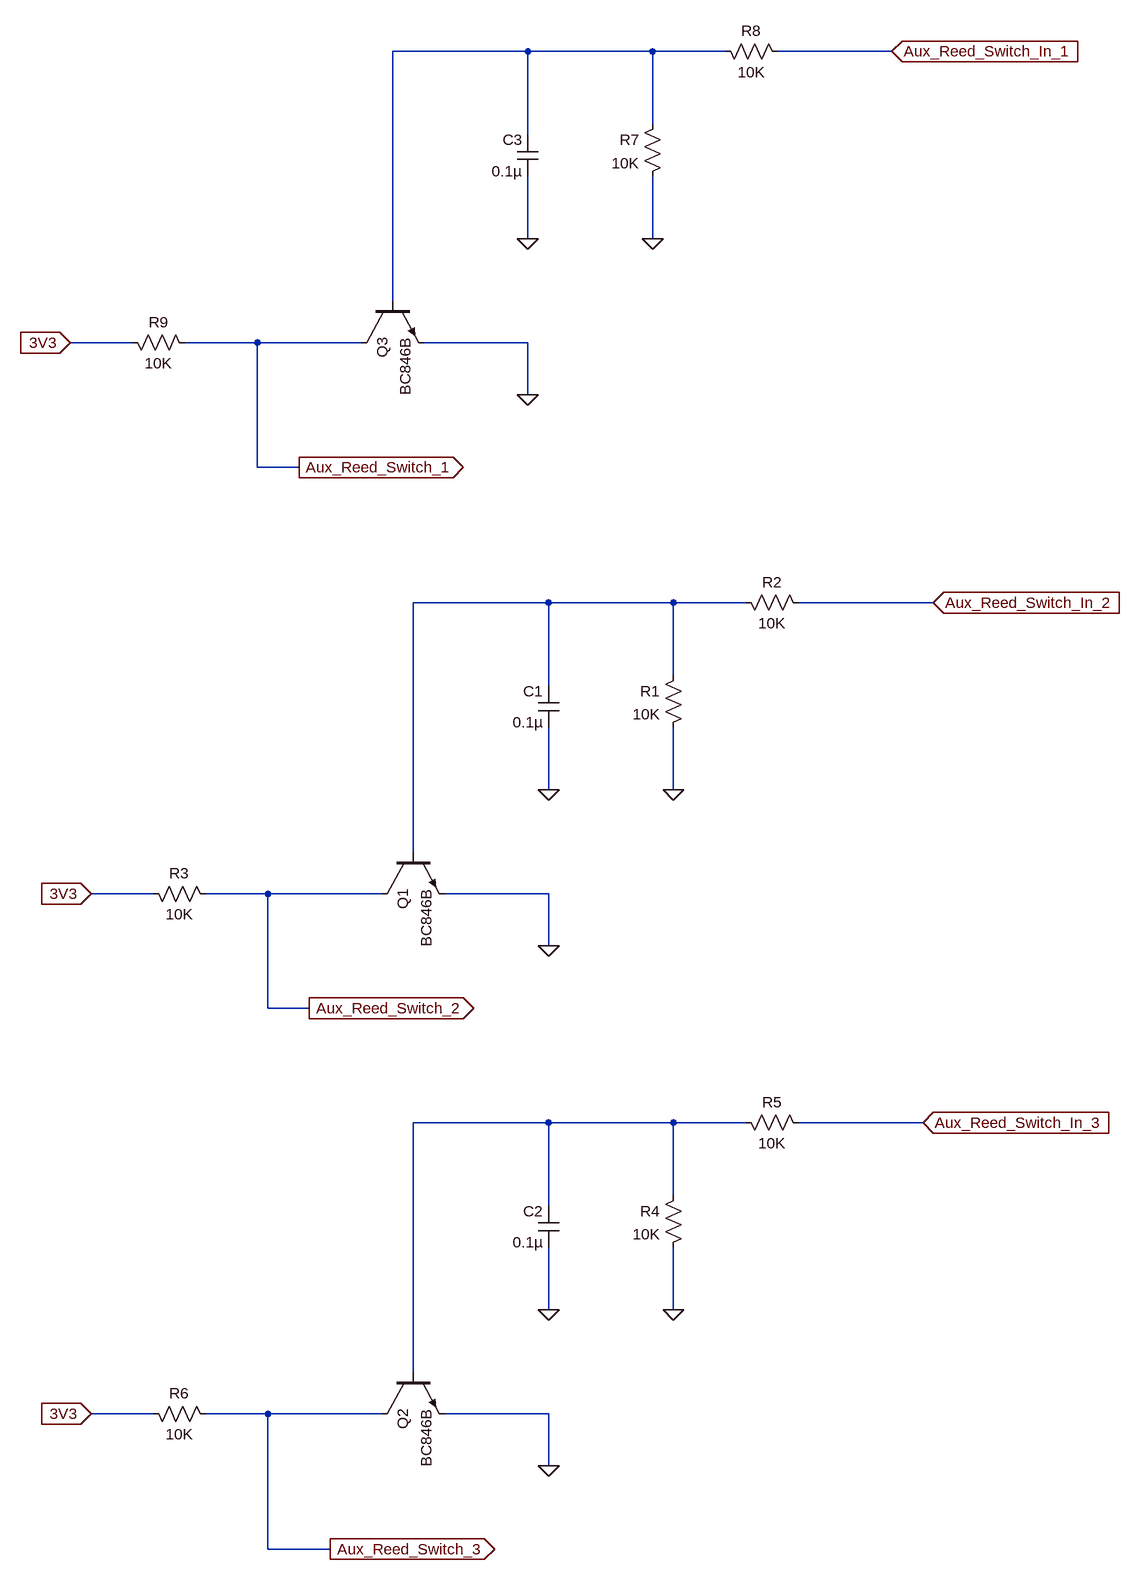
[diagram p0: schematic reed_switch.asc]
reed_switch.asc, the LTspice schematic file:
Version 4
SHEET 1 1608 1692
WIRE 544 -752 336 -752
WIRE 736 -752 544 -752
WIRE 848 -752 736 -752
WIRE 1104 -752 928 -752
WIRE 736 -640 736 -752
WIRE 544 -624 544 -752
WIRE 544 -464 544 -560
WIRE 736 -464 736 -560
WIRE 336 -368 336 -752
WIRE -64 -304 -160 -304
WIRE 128 -304 16 -304
WIRE 288 -304 128 -304
WIRE 544 -304 384 -304
WIRE 544 -224 544 -304
WIRE 128 -112 128 -304
WIRE 192 -112 128 -112
WIRE 576 96 368 96
WIRE 768 96 576 96
WIRE 880 96 768 96
WIRE 1168 96 960 96
WIRE 768 208 768 96
WIRE 576 224 576 96
WIRE 576 384 576 288
WIRE 768 384 768 288
WIRE 368 480 368 96
WIRE -32 544 -128 544
WIRE 144 544 48 544
WIRE 320 544 144 544
WIRE 576 544 416 544
WIRE 576 624 576 544
WIRE 144 720 144 544
WIRE 208 720 144 720
WIRE 576 896 368 896
WIRE 768 896 576 896
WIRE 880 896 768 896
WIRE 1152 896 960 896
WIRE 768 1008 768 896
WIRE 576 1024 576 896
WIRE 576 1184 576 1088
WIRE 768 1184 768 1088
WIRE 368 1280 368 896
WIRE -32 1344 -128 1344
WIRE 144 1344 48 1344
WIRE 320 1344 144 1344
WIRE 576 1344 416 1344
WIRE 576 1424 576 1344
WIRE 144 1552 144 1344
WIRE 240 1552 144 1552
FLAG 768 384 0
FLAG 576 384 0
FLAG 576 624 0
FLAG 208 720 Aux_Reed_Switch_2
IOPIN 208 720 Out
FLAG -128 544 3V3
IOPIN -128 544 In
FLAG 768 1184 0
FLAG 576 1184 0
FLAG 576 1424 0
FLAG 240 1552 Aux_Reed_Switch_3
IOPIN 240 1552 Out
FLAG -128 1344 3V3
IOPIN -128 1344 In
FLAG 736 -464 0
FLAG 544 -464 0
FLAG 544 -224 0
FLAG 192 -112 Aux_Reed_Switch_1
IOPIN 192 -112 Out
FLAG -160 -304 3V3
IOPIN -160 -304 In
FLAG 1104 -752 Aux_Reed_Switch_In_1
IOPIN 1104 -752 In
FLAG 1168 96 Aux_Reed_Switch_In_2
IOPIN 1168 96 In
FLAG 1152 896 Aux_Reed_Switch_In_3
IOPIN 1152 896 In
SYMBOL res 784 192 M0
SYMATTR InstName R1
SYMATTR Value 10K
SYMATTR SpiceLine tol=1 pwr=0.1
SYMBOL res 864 80 M90
WINDOW 0 0 56 VBottom 2
WINDOW 3 32 56 VTop 2
SYMATTR InstName R2
SYMATTR Value 10K
SYMATTR SpiceLine tol=1 pwr=0.1
SYMBOL res -48 528 M90
WINDOW 0 0 56 VBottom 2
WINDOW 3 32 56 VTop 2
SYMATTR InstName R3
SYMATTR Value 10K
SYMBOL npn 320 480 M90
SYMATTR InstName Q1
SYMATTR Value BC846B
SYMBOL cap 592 224 M0
SYMATTR InstName C1
SYMATTR Value 0.1µ
SYMATTR SpiceLine V=6.3 Irms=2.1 Rser=0.0606238 Lser=0 mfg="KEMET" pn="C1210C104K9RAC" type="X7R"
SYMBOL res 784 992 M0
SYMATTR InstName R4
SYMATTR Value 10K
SYMATTR SpiceLine tol=1 pwr=0.1
SYMBOL res 864 880 M90
WINDOW 0 0 56 VBottom 2
WINDOW 3 32 56 VTop 2
SYMATTR InstName R5
SYMATTR Value 10K
SYMATTR SpiceLine tol=1 pwr=0.1
SYMBOL res -48 1328 M90
WINDOW 0 0 56 VBottom 2
WINDOW 3 32 56 VTop 2
SYMATTR InstName R6
SYMATTR Value 10K
SYMBOL npn 320 1280 M90
SYMATTR InstName Q2
SYMATTR Value BC846B
SYMBOL cap 592 1024 M0
SYMATTR InstName C2
SYMATTR Value 0.1µ
SYMATTR SpiceLine V=6.3 Irms=2.1 Rser=0.0606238 Lser=0 mfg="KEMET" pn="C1210C104K9RAC" type="X7R"
SYMBOL res 752 -656 M0
SYMATTR InstName R7
SYMATTR Value 10K
SYMATTR SpiceLine tol=1 pwr=0.1
SYMBOL res 832 -768 M90
WINDOW 0 0 56 VBottom 2
WINDOW 3 32 56 VTop 2
SYMATTR InstName R8
SYMATTR Value 10K
SYMATTR SpiceLine tol=1 pwr=0.1
SYMBOL res -80 -320 M90
WINDOW 0 0 56 VBottom 2
WINDOW 3 32 56 VTop 2
SYMATTR InstName R9
SYMATTR Value 10K
SYMBOL npn 288 -368 M90
SYMATTR InstName Q3
SYMATTR Value BC846B
SYMBOL cap 560 -624 M0
SYMATTR InstName C3
SYMATTR Value 0.1µ
SYMATTR SpiceLine V=6.3 Irms=2.1 Rser=0.0606238 Lser=0 mfg="KEMET" pn="C1210C104K9RAC" type="X7R"

The netlist it stands for:
* reed_switch.asc
R1 N002 0 10K tol=1 pwr=0.1
R2 N002 Aux_Reed_Switch_In_2 10K tol=1 pwr=0.1
R3 3V3 Aux_Reed_Switch_2 10K
Q1 Aux_Reed_Switch_2 N002 0 0 BC846B
C1 N002 0 0.1µ V=6.3 Irms=2.1 Rser=0.0606238 Lser=0 mfg="KEMET" pn="C1210C104K9RAC" type="X7R"
R4 N003 0 10K tol=1 pwr=0.1
R5 N003 Aux_Reed_Switch_In_3 10K tol=1 pwr=0.1
R6 3V3 Aux_Reed_Switch_3 10K
Q2 Aux_Reed_Switch_3 N003 0 0 BC846B
C2 N003 0 0.1µ V=6.3 Irms=2.1 Rser=0.0606238 Lser=0 mfg="KEMET" pn="C1210C104K9RAC" type="X7R"
R7 N001 0 10K tol=1 pwr=0.1
R8 N001 Aux_Reed_Switch_In_1 10K tol=1 pwr=0.1
R9 3V3 Aux_Reed_Switch_1 10K
Q3 Aux_Reed_Switch_1 N001 0 0 BC846B
C3 N001 0 0.1µ V=6.3 Irms=2.1 Rser=0.0606238 Lser=0 mfg="KEMET" pn="C1210C104K9RAC" type="X7R"
.model NPN NPN
.model PNP PNP
.lib standard.bjt
.backanno
.end